# EAGLE schematic PWM-Power-Box_simplified_R1.0 (EAGLE 9.5.0)
REV: 1

## Sheet 1 of 7
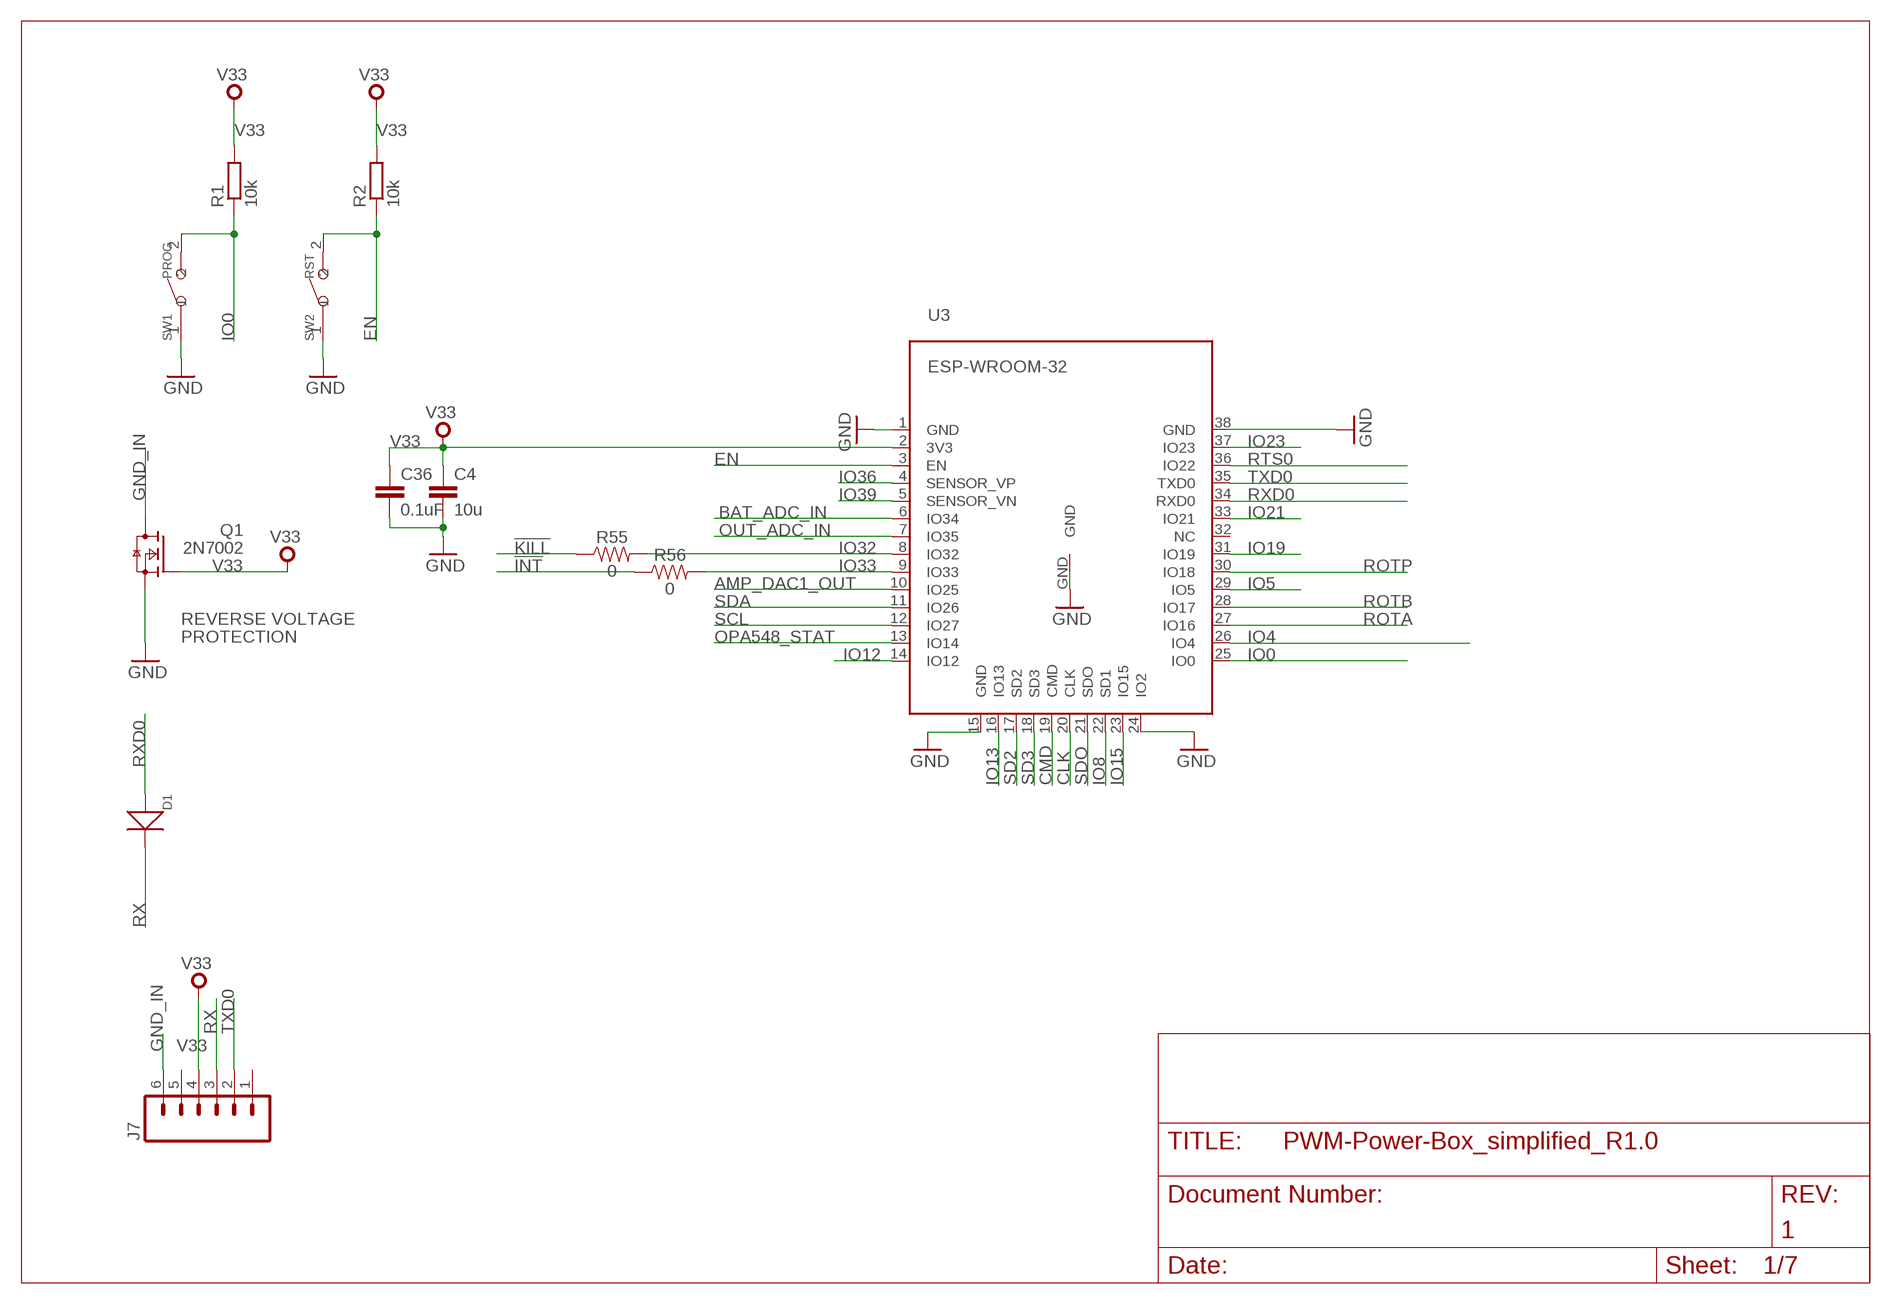
[diagram p0: schematic, sheet 1]

### Parts
C4  10u  C-EUC0603  [C0603]
C36  0.1uF  C-EUC0603  [C0603]
D1  DIODE'0805'  [SOD-323]
J7  M06SILK_FEMALE_PTH  [1X06]
Q1  2N7002  2N7002E  [SOT23]
R1  10k  R-EU_R0603  [R0603]
R2  10k  R-EU_R0603  [R0603]
R55  0  1KOHM-0603-1/10W-1%  [0603]
R56  0  1KOHM-0603-1/10W-1%  [0603]
SW1  PROG  SMD-BUTTON(2P-6.0X3.0X2.5MM)-DHT-1163S  [SW2-4.0-6.0X3.0X2.5MM]
SW2  RST  SMD-BUTTON(2P-6.0X3.0X2.5MM)-DHT-1163S  [SW2-4.0-6.0X3.0X2.5MM]
U3  ESP-WROOM-32  [ESP-WROOM-32]

### Nets
!INT: R56.1 ; also sheet 6
!KILL: R55.1 ; also sheet 6
AMP_DAC1_OUT: U3.10(IO25) ; also sheet 3
BAT_ADC_IN: U3.6(IO34) ; also sheet 5
CLK: U3.20(CLK)
CMD: U3.19(CMD)
EN: R2.1 SW2.2 U3.3(EN) ; also sheet 4
GND [gnd]: C4.2 C36.2 Q1.2(S) SW1.1 SW2.1 U3.1(GND) U3.15(GND) U3.24(IO2) U3.38(GND) U3.GND ; also sheet 2,3,4,5,6
GND_IN [gnd]: J7.6 Q1.3(D)
IO0: R1.1 SW1.2 U3.25(IO0) ; also sheet 4
IO4: U3.26(IO4)
IO5: U3.29(IO5)
IO8: U3.22(SD1)
IO12: U3.14(IO12)
IO13: U3.16(IO13)
IO15: U3.23(IO15)
IO19: U3.31(IO19)
IO21: U3.33(IO21)
IO23: U3.37(IO23)
IO32: R55.2 U3.8(IO32)
IO33: R56.2 U3.9(IO33)
IO36: U3.4(SENSOR_VP)
IO39: U3.5(SENSOR_VN)
OPA548_STAT: U3.13(IO14) ; also sheet 3
OUT_ADC_IN: U3.7(IO35) ; also sheet 5
ROTA: U3.27(IO16) ; also sheet 4
ROTB: U3.28(IO17) ; also sheet 4
ROTP: U3.30(IO18) ; also sheet 4
RTS0: U3.36(IO22)
RX: D1.- J7.3
RXD0: D1.+ U3.34(RXD0) ; also sheet 4
SCL: U3.12(IO27) ; also sheet 4
SD2: U3.17(SD2)
SD3: U3.18(SD3)
SDA: U3.11(IO26) ; also sheet 4
SDO: U3.21(SDO)
TXD0: J7.2 U3.35(TXD0) ; also sheet 4
V33: C4.1 C36.1 J7.4 Q1.1(G) R1.2 R2.2 U3.2(3V3) ; also sheet 2,3,4,5
Unconnected: J7.1 J7.5 U3.32(NC)

### Notes on the sheet
- REVERSE VOLTAGE
- PROTECTION

## Sheet 2 of 7
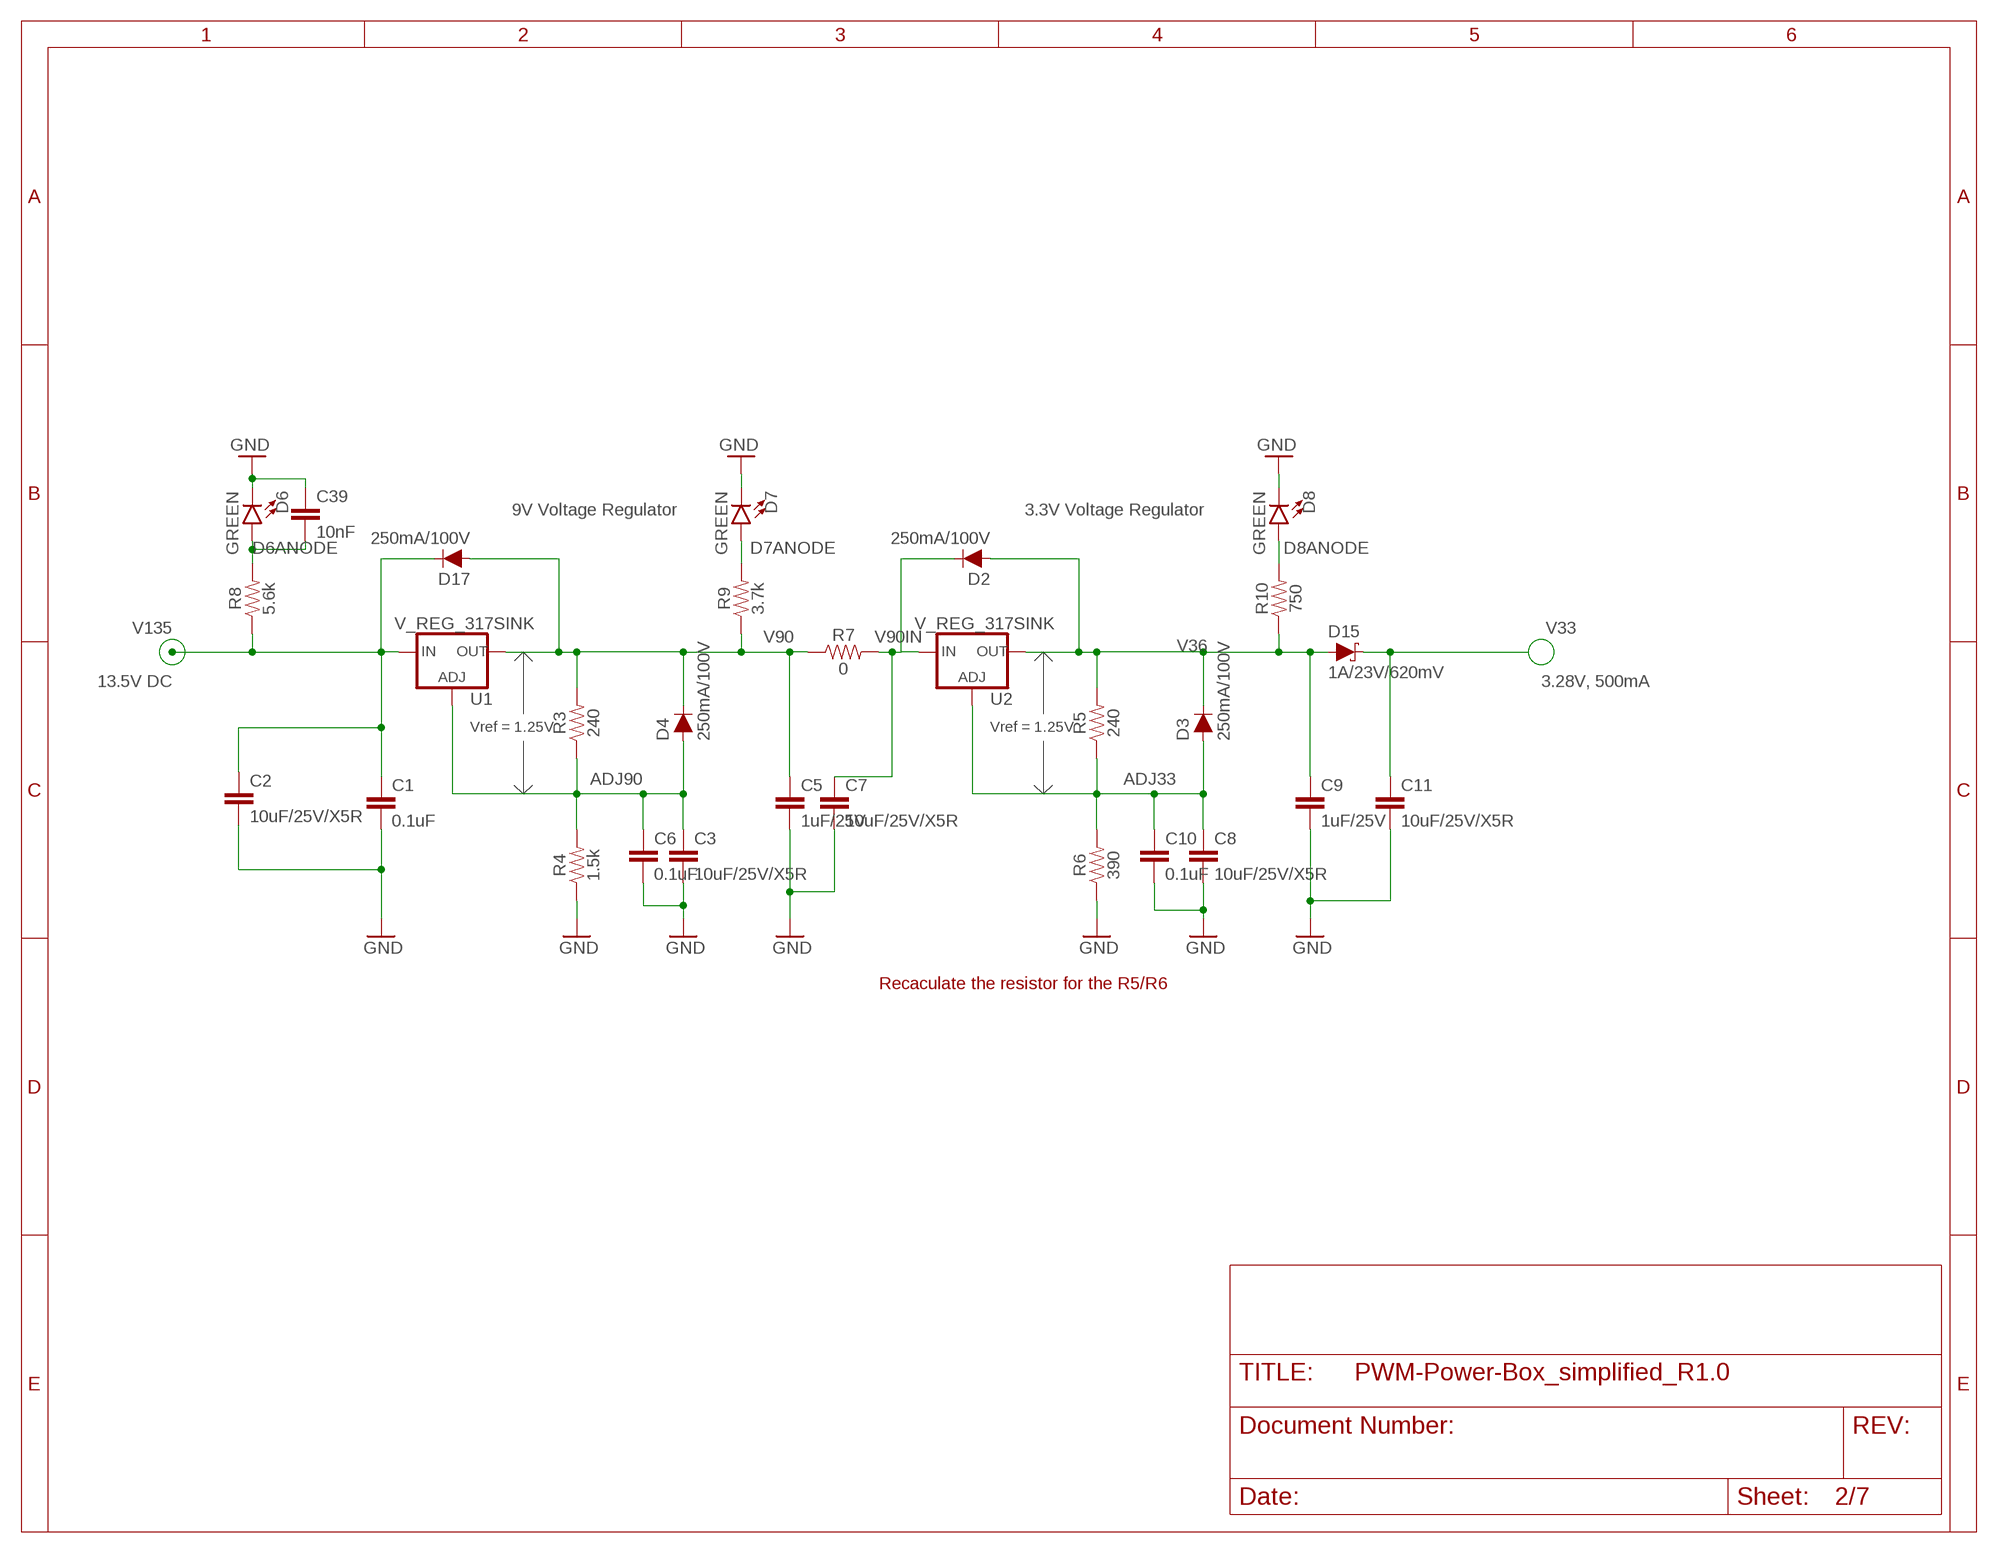
[diagram p1: schematic, sheet 2]

### Parts
C1  0.1uF  C-EUC0805K  [C0805K]
C2  10uF/25V/X5R  C-EUC1210K  [C1210K]
C3  10uF/25V/X5R  C-EUC0805  [C0805]
C5  1uF/25V  C-EUC0805K  [C0805K]
C6  0.1uF  C-EUC0603  [C0603]
C7  10uF/25V/X5R  C-EUC1210K  [C1210K]
C8  10uF/25V/X5R  C-EUC0603  [C0603]
C9  1uF/25V  C-EUC0805K  [C0805K]
C10  0.1uF  C-EUC0603  [C0603]
C11  10uF/25V/X5R  C-EUC1210K  [C1210K]
C39  10nF  C-EUC0603  [C0603]
D2  250mA/100V  DIODE-BAS16J  [SOD-323]
D3  250mA/100V  DIODE-BAS16J  [SOD-323]
D4  250mA/100V  DIODE-BAS16J  [SOD-323]
D6  GREEN  LED-GREEN0603  [LED-0603]
D7  GREEN  LED-GREEN0603  [LED-0603]
D8  GREEN  LED-GREEN0603  [LED-0603]
D15  1A/23V/620mV  DIODE-SCHOTTKY-BAT20J  [SOD-323]
D17  250mA/100V  DIODE-BAS16J  [SOD-323]
R3  240  1.5KOHM-0603-1/10W-1%  [0603]
R4  1.5k  1.5KOHM-0603-1/10W-1%  [0603]
R5  240  1.5KOHM-0603-1/10W-1%  [0603]
R6  390  1.5KOHM-0603-1/10W-1%  [0603]
R7  0  0.1OHM-1210-1/2W-1%  [1210]
R8  5.6k  1.5KOHM-0603-1/10W-1%  [0603]
R9  3.7k  1.5KOHM-0603-1/10W-1%  [0603]
R10  750  1.5KOHM-0603-1/10W-1%  [0603]
U1  V_REG_317SINK  [TO220-ADJ]
U2  V_REG_317SINK  [TO220-ADJ]

### Nets
ADJ33: C8.1 C10.1 D3.A R5.1 R6.2 U2.ADJ
ADJ90: C3.1 C6.1 D4.A R3.1 R4.2 U1.ADJ
D6ANODE: C39.2 D6.A R8.2
D7ANODE: D7.A R9.2
D8ANODE: D8.A R10.2
GND [gnd]: C1.2 C2.2 C3.2 C5.2 C6.2 C7.2 C8.2 C9.2 C10.2 C11.2 C39.1 D6.C D7.C D8.C R4.1 R6.1 ; also sheet 1,3,4,5,6
V33: C11.1 D15.C ; also sheet 1,3,4,5
V36: C9.1 D2.A D3.C D15.A R5.2 R10.1 U2.OUT
V90: C5.1 D4.C D17.A R3.2 R7.1 R9.1 U1.OUT
V90IN: C7.1 D2.C R7.2 U2.IN
V135: C1.1 C2.1 D17.C R8.1 U1.IN ; also sheet 3,5,6

### Notes on the sheet
- 9V Voltage Regulator | 3.3V Voltage Regulator
- 13.5V DC | 3.28V, 500mA
- Vref = 1.25V | Vref = 1.25V
- Recaculate the resistor for the R5/R6

## Sheet 3 of 7
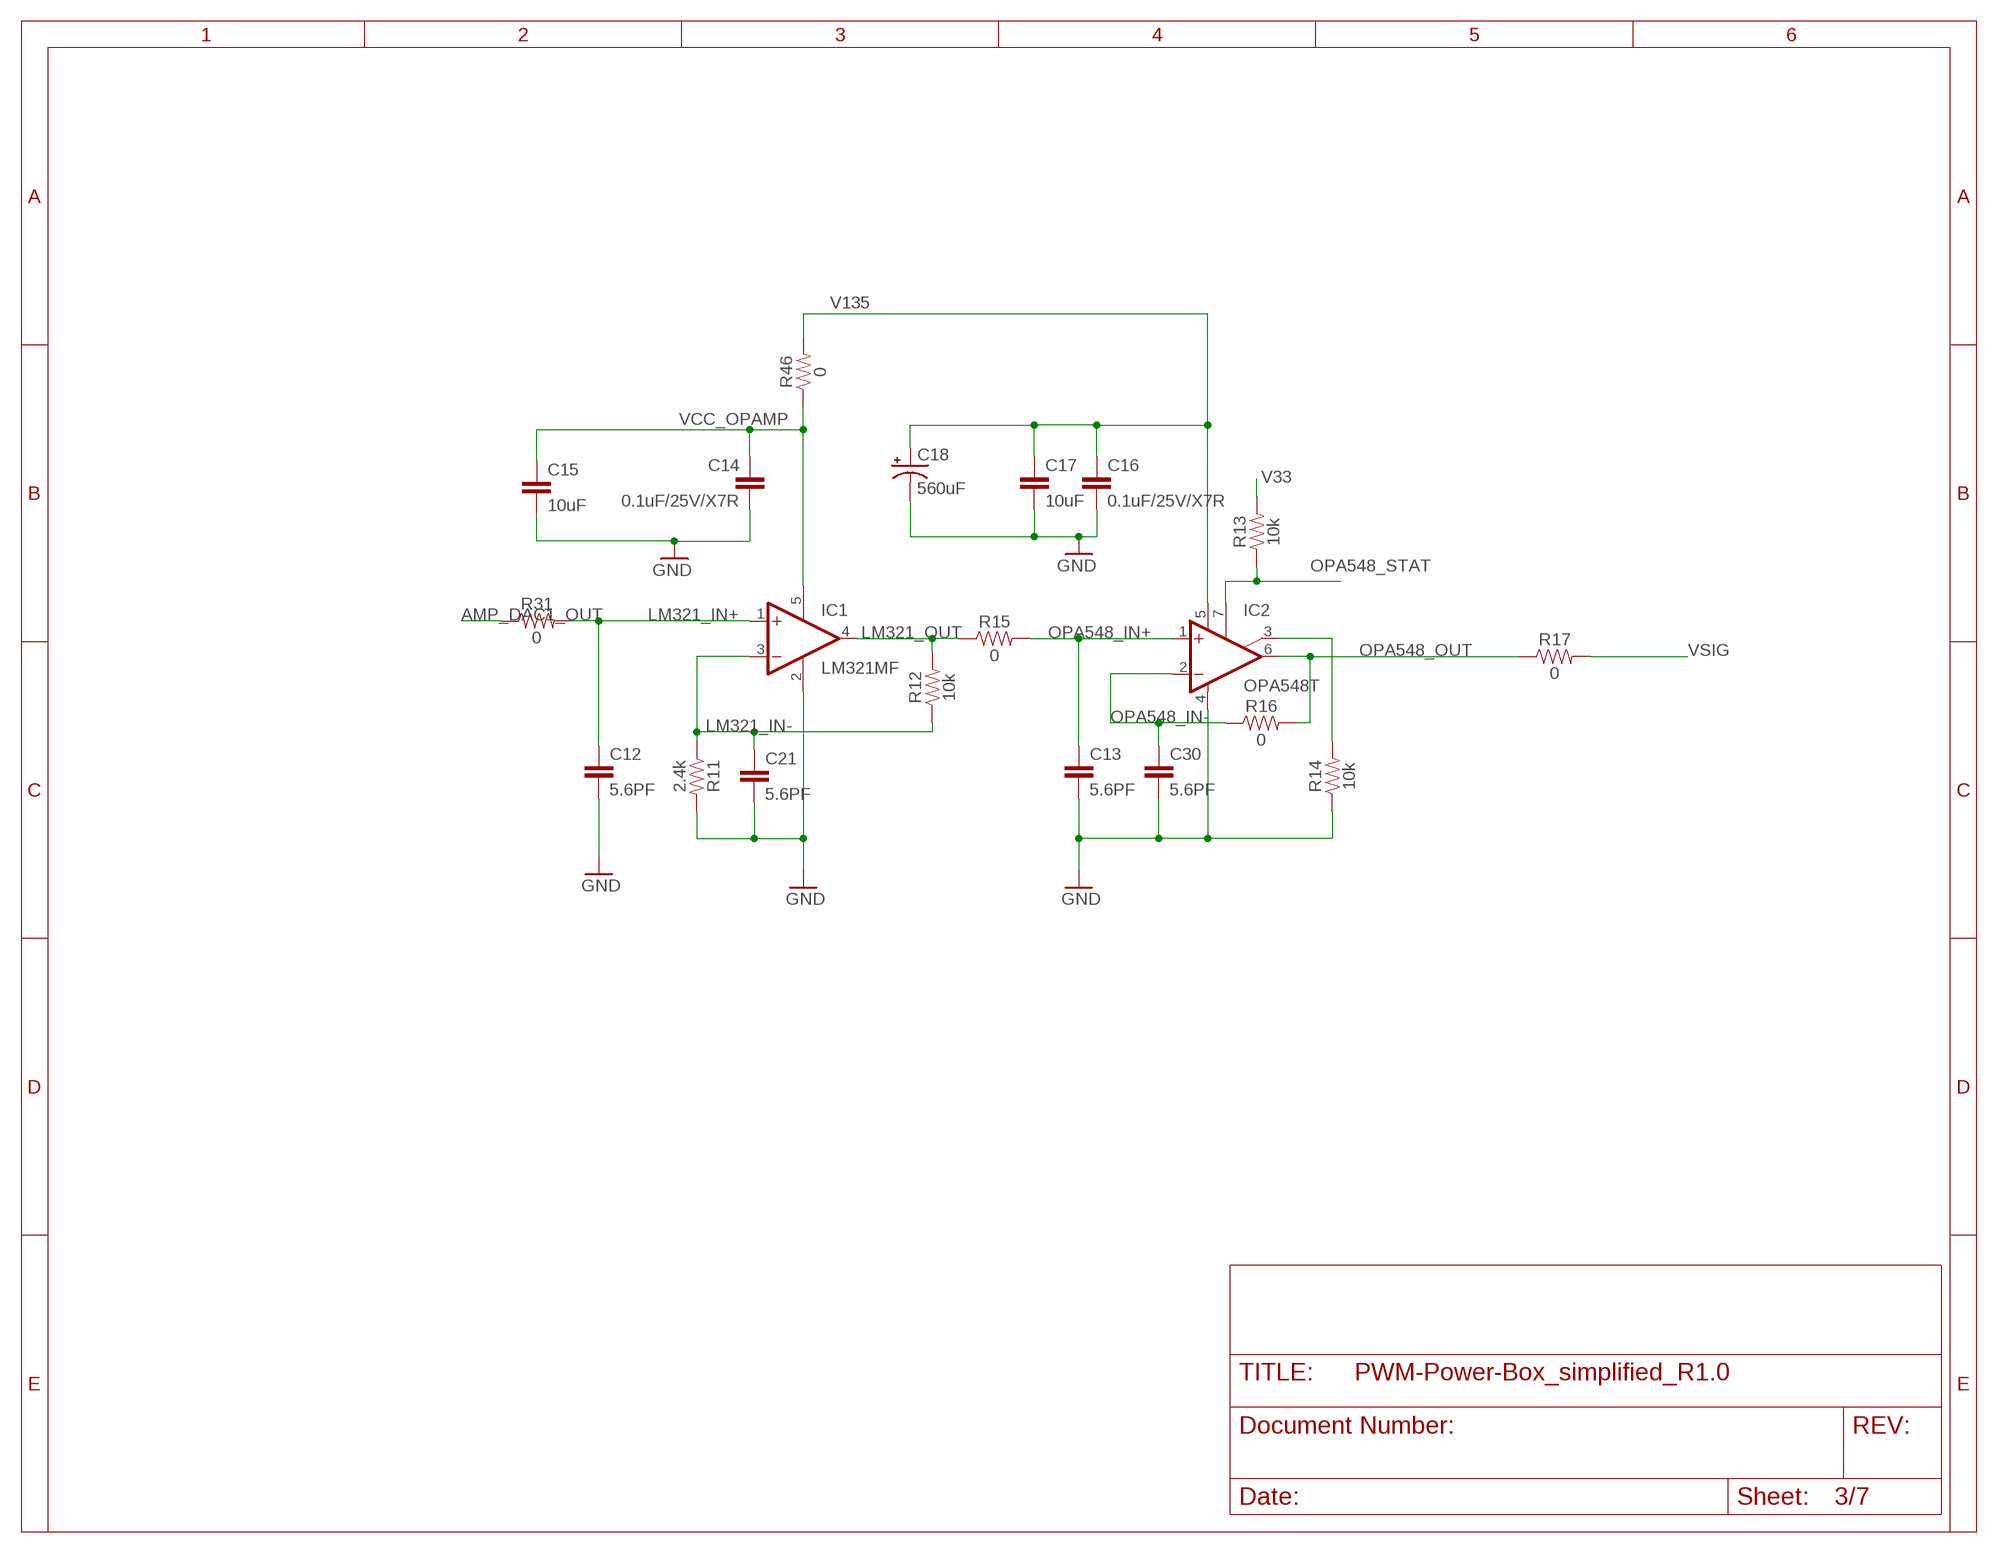
[diagram p2: schematic, sheet 3]

### Parts
C12  5.6PF  5.6PF-0603-50V-5%  [0603]
C13  5.6PF  5.6PF-0603-50V-5%  [0603]
C14  0.1uF/25V/X7R  5.6PF-0603-50V-5%  [0603]
C15  10uF  10UF-1206-6.3V-20%  [1206]
C16  0.1uF/25V/X7R  5.6PF-0603-50V-5%  [0603]
C17  10uF  10UF-1206-6.3V-20%  [1206]
C18  560uF  560UF-PANASONIC_G-25V-20%  [PANASONIC_G]
C21  5.6PF  5.6PF-0603-50V-5%  [0603]
C30  5.6PF  5.6PF-0603-50V-5%  [0603]
IC1  LM321MF  [SOT23-5]
IC2  OPA548T  [TO220-7]
R11  2.4k  1.5KOHM-0603-1/10W-1%  [0603]
R12  10k  1.5KOHM-0603-1/10W-1%  [0603]
R13  10k  1.5KOHM-0603-1/10W-1%  [0603]
R14  10k  1.5KOHM-0603-1/10W-1%  [0603]
R15  0  1.5KOHM-0603-1/10W-1%  [0603]
R16  0  1.5KOHM-0603-1/10W-1%  [0603]
R17  0  0.1OHM-1210-1/2W-1%  [1210]
R31  0  1.5KOHM-0603-1/10W-1%  [0603]
R46  0  1.5KOHM-0603-1/10W-1%  [0603]

### Nets
AMP_DAC1_OUT: R31.1 ; also sheet 1
GND [gnd]: C12.2 C13.2 C14.2 C15.2 C16.2 C17.2 C18.- C21.2 C30.2 IC1.2(V-) IC2.4(V-) R11.2 R14.1 ; also sheet 1,2,4,5,6
LM321_IN+: C12.1 IC1.1(+IN) R31.2
LM321_IN-: C21.1 IC1.3(-IN) R11.1 R12.1
LM321_OUT: IC1.4(OUT) R12.2 R15.1
N$12: IC2.3(ILIM) R14.2
OPA548_IN+: C13.1 IC2.1(+IN) R15.2
OPA548_IN-: C30.1 IC2.2(-IN) R16.1
OPA548_OUT: IC2.6(OUT) R16.2 R17.1 ; also sheet 5
OPA548_STAT: IC2.7(E/S) R13.1 ; also sheet 1
V33: R13.2 ; also sheet 1,2,4,5
V135: C16.1 C17.1 C18.+ IC2.5(V+) R46.2 ; also sheet 2,5,6
VCC_OPAMP: C14.1 C15.1 IC1.5(V+) R46.1
VSIG: R17.2 ; also sheet 6

## Sheet 4 of 7
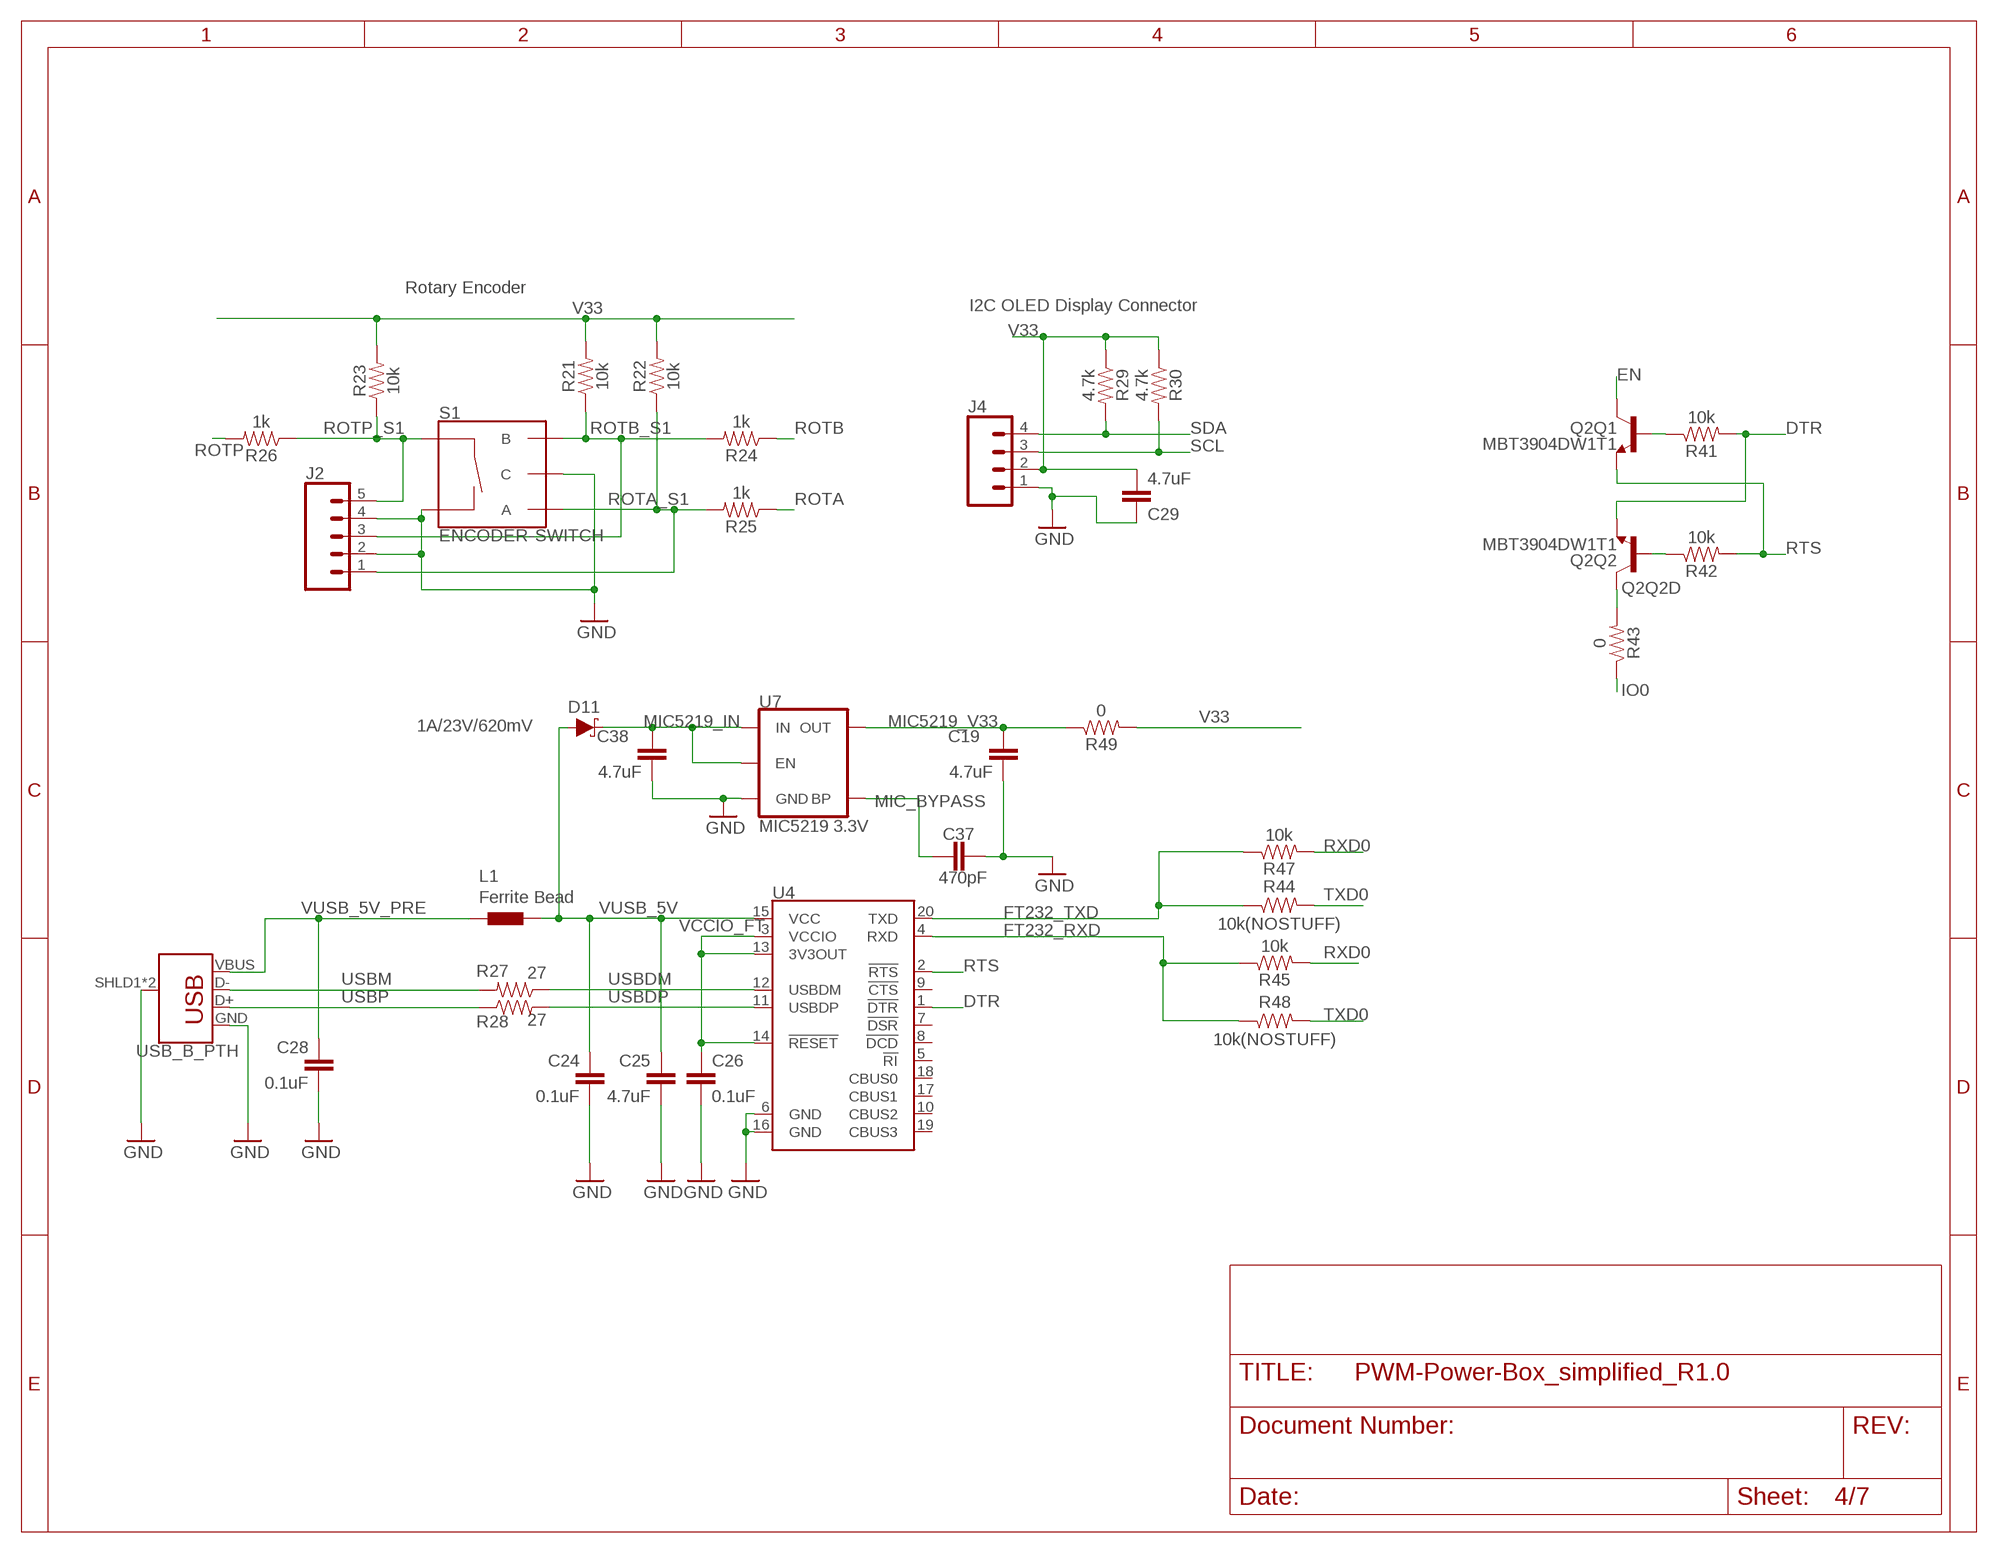
[diagram p3: schematic, sheet 4]

### Parts
C19  4.7uF  5.6PF-0603-50V-5%  [0603]
C24  0.1uF  5.6PF-0603-50V-5%  [0603]
C25  4.7uF  5.6PF-0603-50V-5%  [0603]
C26  0.1uF  5.6PF-0603-50V-5%  [0603]
C28  0.1uF  5.6PF-0603-50V-5%  [0603]
C29  4.7uF  5.6PF-0603-50V-5%  [0603]
C37  470pF  5.6PF-0603-50V-5%  [0603]
C38  4.7uF  5.6PF-0603-50V-5%  [0603]
D11  1A/23V/620mV  DIODE-SCHOTTKY-BAT20J  [SOD-323]
J2  CONN_05  [1X05]
J3  USB_B_PTH  [USB-B-PTH]
J4  CONN_04  [1X04]
L1  Ferrite Bead  BLM15HB121SN1  [0402]
Q2  MBT3904DW1T1  TRANS_NPN_DUAL-MBT3904DW1T1  [SC70-6]
R21  10k  1.5KOHM-0603-1/10W-1%  [0603]
R22  10k  1.5KOHM-0603-1/10W-1%  [0603]
R23  10k  1.5KOHM-0603-1/10W-1%  [0603]
R24  1k  1.5KOHM-0603-1/10W-1%  [0603]
R25  1k  1.5KOHM-0603-1/10W-1%  [0603]
R26  1k  1.5KOHM-0603-1/10W-1%  [0603]
R27  27  1.5KOHM-0603-1/10W-1%  [0603]
R28  27  1.5KOHM-0603-1/10W-1%  [0603]
R29  4.7k  1.5KOHM-0603-1/10W-1%  [0603]
R30  4.7k  1.5KOHM-0603-1/10W-1%  [0603]
R41  10k  1.5KOHM-0603-1/10W-1%  [0603]
R42  10k  1.5KOHM-0603-1/10W-1%  [0603]
R43  0  1.5KOHM-0603-1/10W-1%  [0603]
R44  10k(NOSTUFF)  1.5KOHM-0603-1/10W-1%  [0603]
R45  10k  1.5KOHM-0603-1/10W-1%  [0603]
R47  10k  1.5KOHM-0603-1/10W-1%  [0603]
R48  10k(NOSTUFF)  1.5KOHM-0603-1/10W-1%  [0603]
R49  0  1.5KOHM-0603-1/10W-1%  [0603]
S1  ENCODER-SWITCH  [ROTARY_ENC_PLAIN]
U4  FT231XS  [SSOP20_L]
U7  MIC5219 3.3V  V_REG_MIC52193.3V  [SOT23-5]

### Nets
DTR: Q2.1(Q2:E) R41.2 U4.1(!DTR)
EN: Q2.3(Q1:C) ; also sheet 1
FT232_RXD: R45.1 R48.1 U4.4(RXD)
FT232_TXD: R44.1 R47.1 U4.20(TXD)
GND [gnd]: C19.2 C24.2 C25.2 C26.2 C28.2 C29.1 C37.2 C38.2 J2.2 J2.4 J3.GND J3.SHLD1(SHIELD) J3.SHLD2(SHIELD) J4.1 S1.C S1.SW- U4.6(GND) U4.16(GND) U7.2(GND) ; also sheet 1,2,3,5,6
IO0: R43.1 ; also sheet 1
MIC5219_IN: C38.1 D11.C U7.1(IN) U7.3(EN)
MIC5219_V33: C19.1 R49.1 U7.5(OUT)
MIC_BYPASS: C37.1 U7.4(BP)
N$27: Q2.5(Q1:B) R41.1
N$33: Q2.2(Q2:B) R42.1
Q2Q2D: Q2.6(Q2:C) R43.2
ROTA: R25.1 ; also sheet 1
ROTA_S1: J2.1 R22.1 R25.2 S1.A
ROTB: R24.1 ; also sheet 1
ROTB_S1: J2.3 R21.1 R24.2 S1.B
ROTP: R26.2 ; also sheet 1
ROTP_S1: J2.5 R23.1 R26.1 S1.SW+
RTS: Q2.4(Q1:E) R42.2 U4.2(!RTS)
RXD0: R45.2 R47.2 ; also sheet 1
SCL: J4.3 R30.2 ; also sheet 1
SDA: J4.4 R29.2 ; also sheet 1
TXD0: R44.2 R48.2 ; also sheet 1
USBDM: R27.1 U4.12(USBDM)
USBDP: R28.2 U4.11(USBDP)
USBM: J3.D- R27.2
USBP: J3.D+ R28.1
V33: C29.2 J4.2 R21.2 R22.2 R23.2 R29.1 R30.1 R49.2 ; also sheet 1,2,3,5
VCCIO_FT: C26.1 U4.3(VCCIO) U4.13(3V3OUT) U4.14(!RESET)
VUSB_5V: C24.1 C25.1 D11.A L1.2 U4.15(VCC)
VUSB_5V_PRE: C28.1 J3.VBUS L1.1
Unconnected: U4.5(!RI) U4.7(!DSR) U4.8(!DCD) U4.9(!CTS) U4.10(CBUS2) U4.17(CBUS1) U4.18(CBUS0) U4.19(CBUS3)

### Notes on the sheet
- Rotary Encoder
- I2C OLED Display Connector

## Sheet 5 of 7
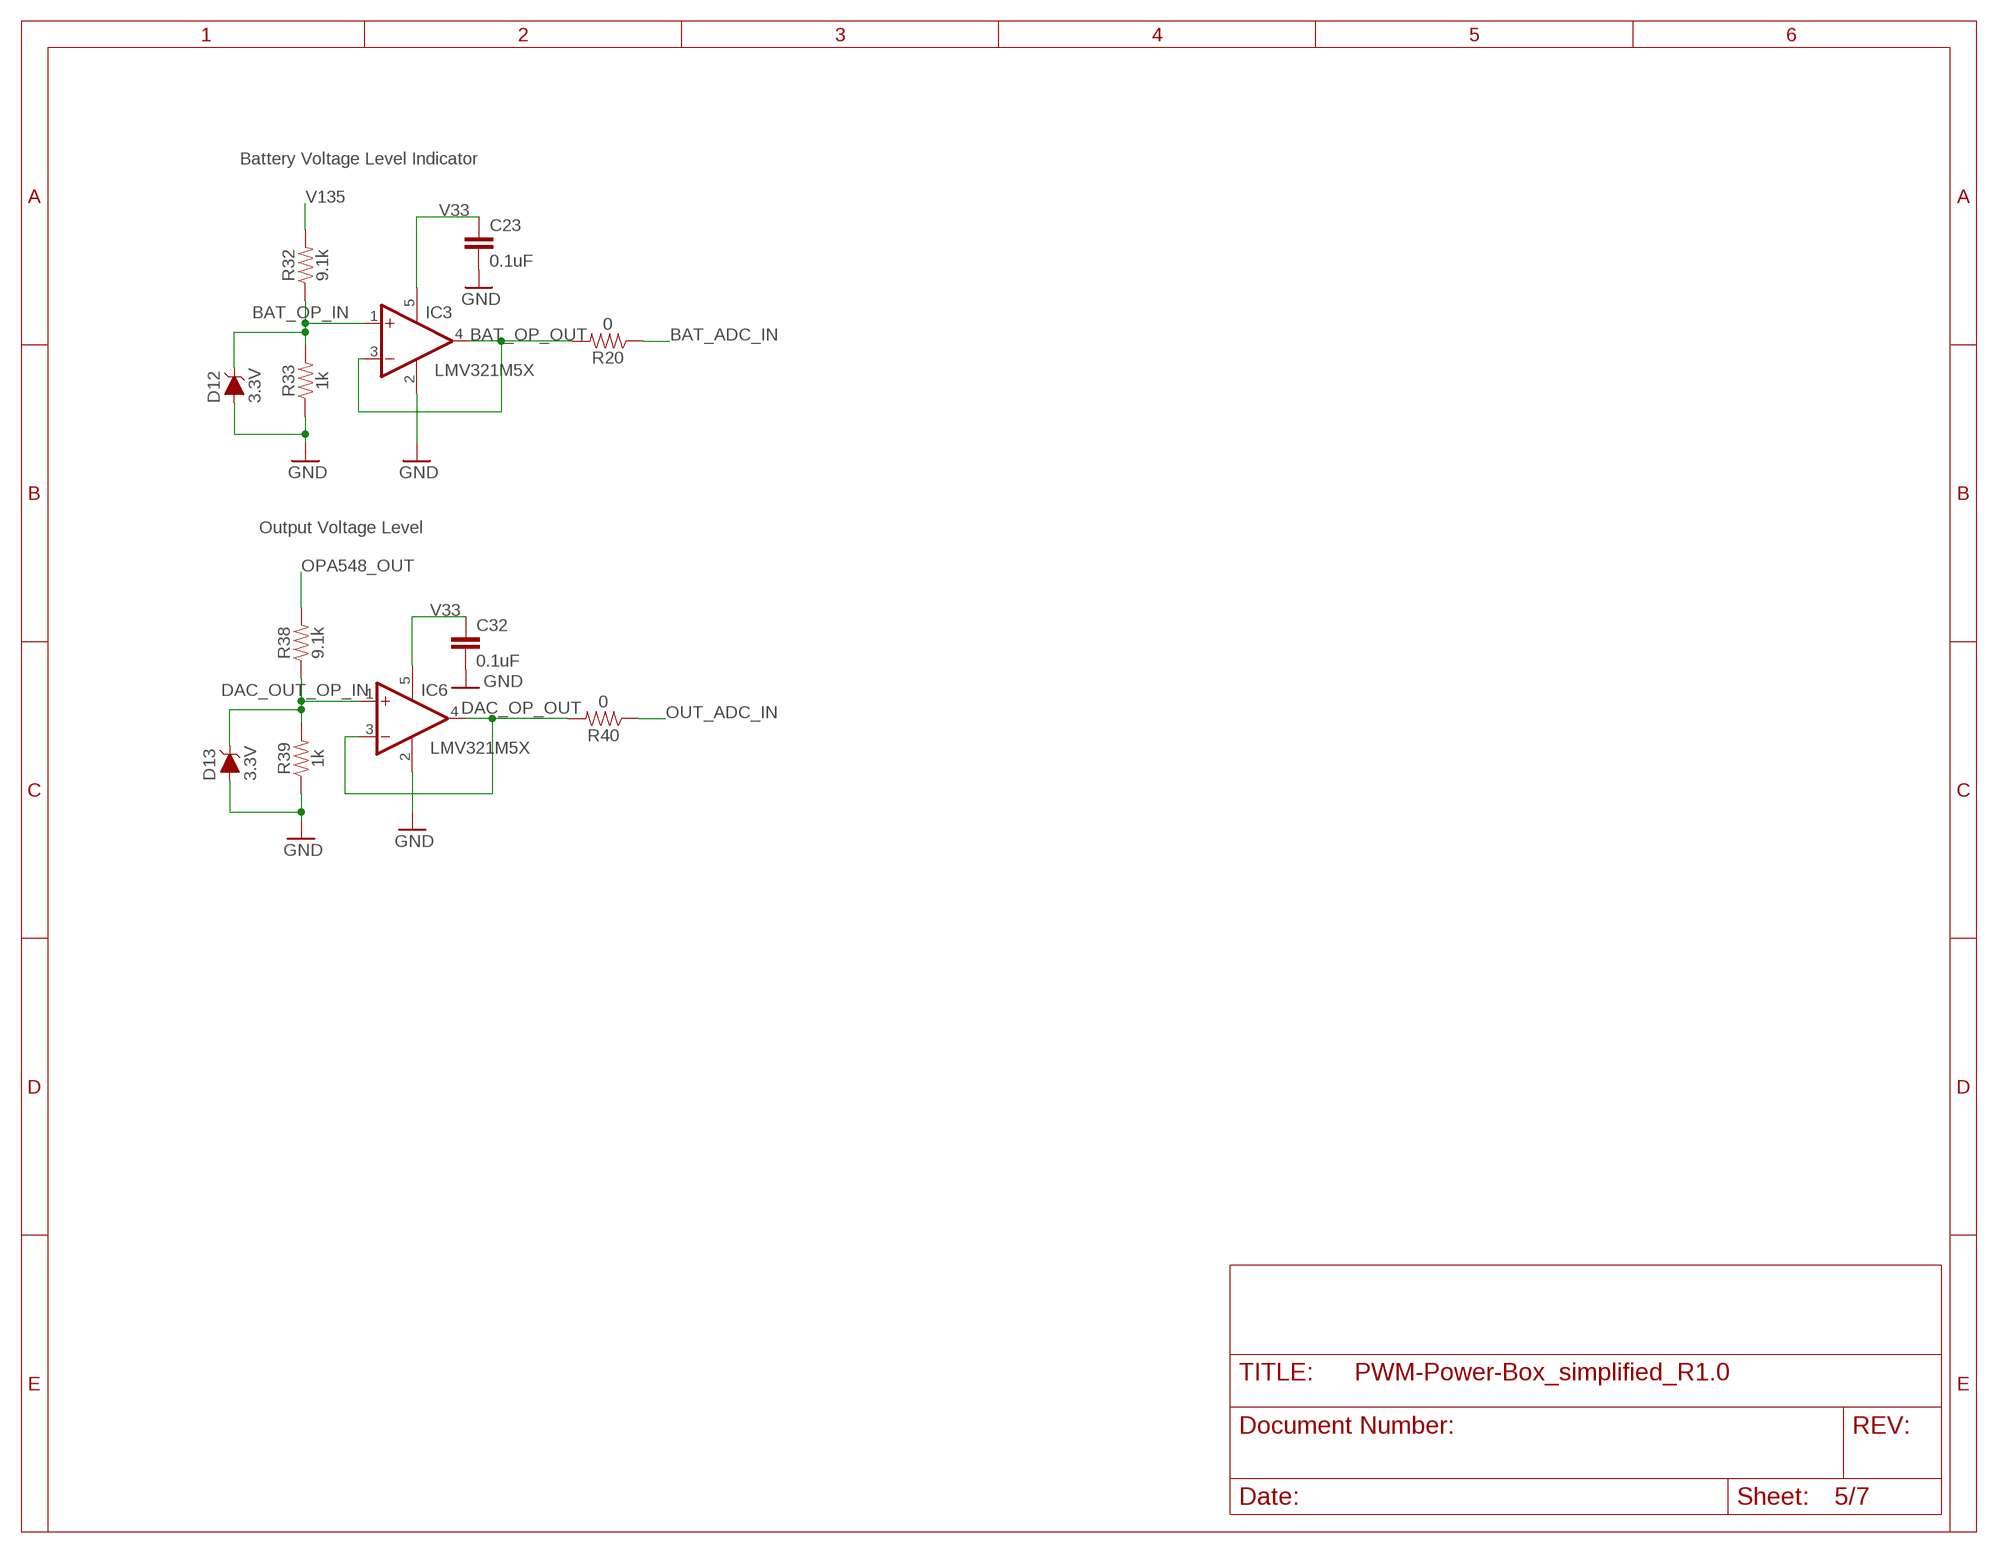
[diagram p4: schematic, sheet 5]

### Parts
C23  0.1uF  5.6PF-0603-50V-5%  [0603]
C32  0.1uF  5.6PF-0603-50V-5%  [0603]
D12  3.3V  DIODE-ZENER-MM3Z3V3T1G  [SOD-323]
D13  3.3V  DIODE-ZENER-MM3Z3V3T1G  [SOD-323]
IC3  LMV321M5X  [SOT23-5]
IC6  LMV321M5X  [SOT23-5]
R20  0  1.5KOHM-0603-1/10W-1%  [0603]
R32  9.1k  1.5KOHM-0603-1/10W-1%  [0603]
R33  1k  1.5KOHM-0603-1/10W-1%  [0603]
R38  9.1k  1.5KOHM-0603-1/10W-1%  [0603]
R39  1k  1.5KOHM-0603-1/10W-1%  [0603]
R40  0  1.5KOHM-0603-1/10W-1%  [0603]

### Nets
BAT_ADC_IN: R20.1 ; also sheet 1
BAT_OP_IN: D12.C IC3.1(+IN) R32.1 R33.2
BAT_OP_OUT: IC3.3(-IN) IC3.4(OUT) R20.2
DAC_OP_OUT: IC6.3(-IN) IC6.4(OUT) R40.2
DAC_OUT_OP_IN: D13.C IC6.1(+IN) R38.1 R39.2
GND [gnd]: C23.2 C32.2 D12.A D13.A IC3.2(V-) IC6.2(V-) R33.1 R39.1 ; also sheet 1,2,3,4,6
OPA548_OUT: R38.2 ; also sheet 3
OUT_ADC_IN: R40.1 ; also sheet 1
V33: C23.1 C32.1 IC3.5(V+) IC6.5(V+) ; also sheet 1,2,3,4
V135: R32.2 ; also sheet 2,3,6

### Notes on the sheet
- Battery Voltage Level Indicator
- Output Voltage Level

## Sheet 6 of 7
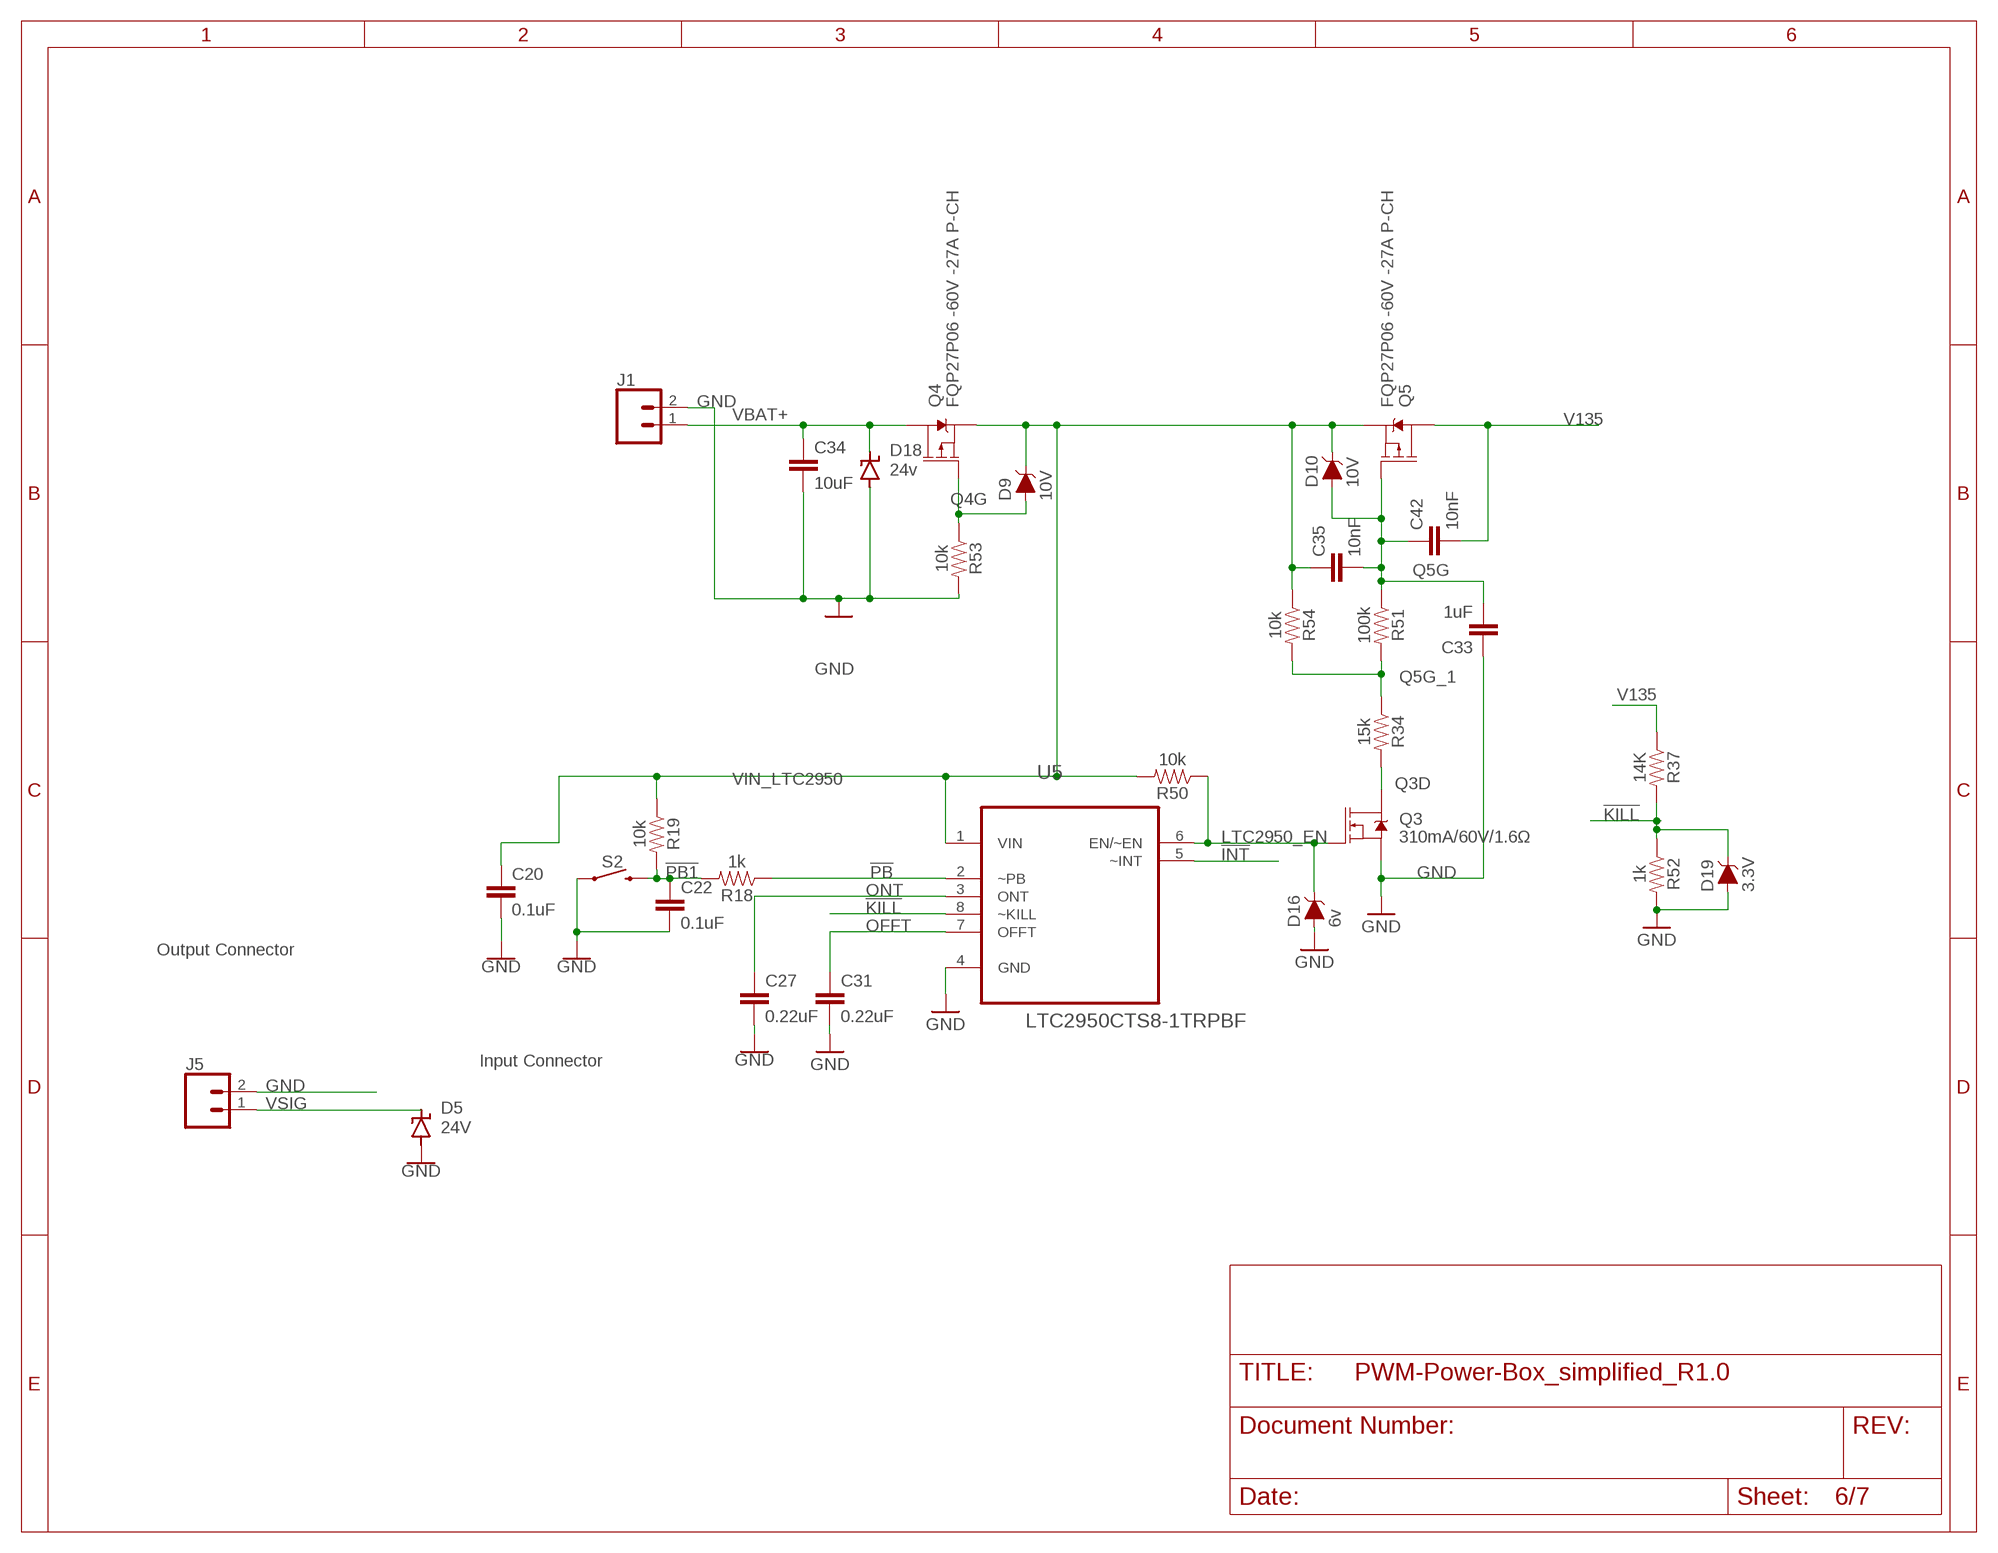
[diagram p5: schematic, sheet 6]

### Parts
C20  0.1uF  10UF-0603-6.3V-20%  [0603]
C22  0.1uF  10UF-0603-6.3V-20%  [0603]
C27  0.22uF  10UF-0603-6.3V-20%  [0603]
C31  0.22uF  10UF-0603-6.3V-20%  [0603]
C33  1uF  10UF-0603-6.3V-20%  [0603]
C34  10uF  10UF-1210-50V-20%  [1210]
C35  10nF  10UF-0603-6.3V-20%  [0603]
C42  10nF  10UF-0603-6.3V-20%  [0603]
D5  24V  SUPPRESSOR-SMBG  [SMBG]
D9  10V  DIODE-ZENER-BZT52C3V6S  [SOD-323]
D10  10V  DIODE-ZENER-BZT52C3V6S  [SOD-323]
D16  6v  DIODE-ZENER-BZT52C3V6S  [SOD-323]
D18  24v  SUPPRESSOR-SMBG  [SMBG]
D19  3.3V  DIODE-ZENER-BZT52C3V6S  [SOD-323]
J1  CONN_025MM  [SCREWTERMINAL-5MM-2]
J5  CONN_025MM  [SCREWTERMINAL-5MM-2]
Q3  310mA/60V/1.6Ω  MOSFET-NCH-2N7002PW  [SOT323]
Q4  FQP27P06 -60V -27A P-CH  MOSFET_PCH-NDP6020P  [TO220V]
Q5  FQP27P06 -60V -27A P-CH  MOSFET_PCH-NDP6020P  [TO220V]
R18  1k  100KOHM-0603-1/10W-1%  [0603]
R19  10k  100KOHM-0603-1/10W-1%  [0603]
R34  15k  100KOHM-0603-1/10W-1%  [0603]
R37  14K  100KOHM-0603-1/10W-1%  [0603]
R50  10k  100KOHM-0603-1/10W-1%  [0603]
R51  100k  100KOHM-0603-1/10W-1%  [0603]
R52  1k  100KOHM-0603-1/10W-1%  [0603]
R53  10k  100KOHM-0603-1/10W-1%  [0603]
R54  10k  100KOHM-0603-1/10W-1%  [0603]
S2  MOMENTARY-SWITCH-SPST-PTH-RIGHT-ANGLE-KIT  [TACTILE_SWITCH_PTH_RIGHT_ANGLE_KIT]
U5  LTC2950CTS8-1TRPBF  [SOT65P280X100-8N]

### Nets
!INT: U5.5(~INT) ; also sheet 1
!KILL: D19.C R37.2 R52.1 U5.8(~KILL) ; also sheet 1
!PB: R18.1 U5.2(~PB)
!PB1: C22.1 R18.2 R19.2 S2.2
GND [gnd]: C20.2 C22.2 C27.2 C31.2 C33.1 C34.2 D5.A D16.A D18.A D19.A J1.2 J5.2 Q3.2(S) R52.2 R53.2 S2.1 U5.4(GND) ; also sheet 1,2,3,4,5
LTC2950_EN: D16.C Q3.1(G) R50.1 U5.6(EN/~EN)
OFFT: C31.1 U5.7(OFFT)
ONT: C27.1 U5.3(ONT)
Q3D: Q3.3(D) R34.2
Q4G: D9.A Q4.1(G) R53.1
Q5G: C33.2 C35.2 C42.1 D10.A Q5.1(G) R51.1
Q5G_1: R34.1 R51.2 R54.2
V135: C42.2 Q5.2(D) R37.1 ; also sheet 2,3,5
VBAT+: C34.1 D18.C J1.1 Q4.2(D)
VIN_LTC2950: C20.1 C35.1 D9.C D10.C Q4.3(S) Q5.3(S) R19.1 R50.2 R54.1 U5.1(VIN)
VSIG: D5.C J5.1 ; also sheet 3

### Notes on the sheet
- Output Connector
- Input Connector

## Sheet 7 of 7

## Library data of the parts
C1-C3 C5-C11 C39 = rcl:C-EU: CAPACITOR, European symbol; SPICEPREFIX: C
C4 C36 = rcl:C-EU: CAPACITOR, European symbol
C12 C13 C21 C30 = SparkFun-Capacitors:5.6PF: 5.6pF ceramic capacitors A capacitor is a passive two-terminal electrical component used to store electrical energy temporarily in an electric field.; PROD_ID: CAP-12456
C14 C16 C19 C23-C26 C28 C29 C32 C37 C38 = SparkFun-Capacitors:5.6PF: 5.6pF ceramic capacitors A capacitor is a passive two-terminal electrical component used to store electrical energy temporarily in an electric field.; PROD_ID: CAP-12456; VALUE: 5.6PF
C15 C17 = SparkFun-Capacitors:10UF: 10.0µF ceramic capacitors A capacitor is a passive two-terminal electrical component used to store electrical energy temporarily in an electric field.; PROD_ID: CAP-10057
C18 = SparkFun-Capacitors:560UF: 560µF polarized capacitors A capacitor is a passive two-terminal electrical component used to store electrical energy temporarily in an electric field.; PROD_ID: CAP-09983
C20 C22 C27 C31 C33 C35 C42 = SparkFun-Capacitors:10UF: 10.0µF ceramic capacitors A capacitor is a passive two-terminal electrical component used to store electrical energy temporarily in an electric field.; PROD_ID: CAP-11015; VALUE: 10uF
C34 = SparkFun-Capacitors:10UF: 10.0µF ceramic capacitors A capacitor is a passive two-terminal electrical component used to store electrical energy temporarily in an electric field.; PROD_ID: CAP-09824
D1 = Seeed-OPL-Diode:DIODE*
D2-D4 D17 = SparkFun-DiscreteSemi:DIODE: Diode These are standard reverse protection diodes and small signal diodes. SparkFun Products: SparkFun SparkPunk Sound Kit <https://www.sparkfun.com/products/11177> SparkFun ESP8266 Thing <https://www.sparkfun.com/products/13231>; PROD_ID: DIO-09646
D5 D18 = diode:SUPPRESSOR-: Suppressor diode
D6-D8 = SparkFun-LED:LED-GREEN: Green SMD LED Used in manufacturing of various products at SparkFun Packages: 0603 - SMD 0603 package [Product Link] <http://www.futureelectronics.com/en/technologies/semiconductors/optoelectronics/leds/Pages/9894312-LTST-C190GKT.aspx?CrossPart=HSMG-C190&IM=0> LilyPad 1206 - SMD1206 LilyPad package [Product Link] <http://www.futureelectronics.com/en/Technologies/Product.aspx?ProductID=IN150NGHARVATEKCORPORATION2049943&IM=0> 1206 - SMD1206 package [Product Link] <http://www.futureelectronics.com/en/technologies/semiconductors/optoelectronics/leds/Pages/8315665-LTST-C150KGKT.aspx?IM=0> 1206 Bottom Mount -SMD 1206 Bottom Mount [Product Link] <http://www.digikey.com/product-detail/en/lite-on-inc/LTST-C230KGKT/160-1456-1-ND/386854> SparkFun Products: Pro Mini 328 -5V <https://www.sparkfun.com/products/821> RedBoard <https://www.sparkfun.com/products/12757> MP3 Trigger <https://www.sparkfun.com/products/13720> Makey Makey <https://www.sparkfun.com/products/11076>; PROD_ID: DIO-00821
D9 D10 D16 D19 = SparkFun-DiscreteSemi:DIODE-ZENER: Zener Diode A Zener diode allows current to flow from its anode to its cathode like a normal semiconductor diode, but it also permits current to flow in the reverse direction when its "Zener voltage" is reached. - WIkipedia; PROD_ID: DIO-08199; VALUE: 3.6V
D11 D15 = SparkFun-DiscreteSemi:DIODE-SCHOTTKY: Schottky diode A Schottky diode is a semiconductor diode which has a low forward voltage drop and a very fast switching action.; PROD_ID: DIO-11623
D12 D13 = SparkFun-DiscreteSemi:DIODE-ZENER: Zener Diode A Zener diode allows current to flow from its anode to its cathode like a normal semiconductor diode, but it also permits current to flow in the reverse direction when its "Zener voltage" is reached. - WIkipedia; PROD_ID: DIO-11284
IC1 = linear:LM321?*: Low Power Single Op Amp Source: http://cache.national.com/ds/LM/LM321.pdf
IC2 = burr-brown:OPA548: Operational Amplifier High-Voltage, High-Current; MF: TEXAS INSTRUMENTS; MPN: OPA548T; OC_FARNELL: 1564885; OC_NEWARK: 69K2680
IC3 IC6 = linear:LMV321?*: General Purpose, Low Voltage, Rail-to-Rail Output Operational Amplifiers Source: http://www.national.com/mpf/LM/LMV321.html http://www.national.com/dt/lmv_qual.pdf
J1 J5 = SparkFun-Connectors:CONN_02: Multi connection point. Often used as Generic Header-pin footprint for 0.1 inch spaced/style header connections On any of the 0.1 inch spaced packages, you can populate with these: Break Away Headers - Straight <https://www.sparkfun.com/products/116> (PRT-00116) Break Away Male Headers - Right Angle <https://www.sparkfun.com/products/553> (PRT-00553) Female Headers <https://www.sparkfun.com/products/115> (PRT-00115) Break Away Headers - Machine Pin <https://www.sparkfun.com/products/117> (PRT-00117) Break Away Female Headers - Swiss Machine Pin <https://www.sparkfun.com/products/743> (PRT-00743) For SCREWTERMINALS and SPRING TERMINALS visit here: Screw Terimnals on SparkFun.com <https://www.sparkfun.com/search/results?term=Screw+Terminals> (5mm/3.5mm/2.54mm spacing) This device is also useful as a general connection point to wire up your design to another part of your project. Our various solder wires solder well into these plated through hole pads. Hook-Up Wire - Assortment (Stranded, 22 AWG) <https://www.sparkfun.com/products/11375> (PRT-11375) Hook-Up Wire - Assortment (Solid Core, 22 AWG) <https://www.sparkfun.com/products/11367> (PRT-11367) View the entire wire category on our website here <https://www.sparkfun.com/categories/141> Special notes: Molex polarized connector foot print use with: PRT-08233 with associated crimp pins and housings. 2.54_SCREWTERM for use with PRT-10571. 3.5mm Screw Terminal footprints for PRT-08084 5mm Screw Terminal footprints for use with PRT-08432; SF_SKU: PRT-08432
J2 = SparkFun-Connectors:CONN_05: Multi connection point. Often used as Generic Header-pin footprint for 0.1 inch spaced/style header connections On any of the 0.1 inch spaced packages, you can populate with these: Break Away Headers - Straight <https://www.sparkfun.com/products/116> (PRT-00116) Break Away Male Headers - Right Angle <https://www.sparkfun.com/products/553> (PRT-00553) Female Headers <https://www.sparkfun.com/products/115> (PRT-00115) Break Away Headers - Machine Pin <https://www.sparkfun.com/products/117> (PRT-00117) Break Away Female Headers - Swiss Machine Pin <https://www.sparkfun.com/products/743> (PRT-00743) For SCREWTERMINALS and SPRING TERMINALS visit here: Screw Terimnals on SparkFun.com <https://www.sparkfun.com/search/results?term=Screw+Terminals> (5mm/3.5mm/2.54mm spacing) This device is also useful as a general connection point to wire up your design to another part of your project. Our various solder wires solder well into these plated through hole pads. Hook-Up Wire - Assortment (Stranded, 22 AWG) <https://www.sparkfun.com/products/11375> (PRT-11375) Hook-Up Wire - Assortment (Solid Core, 22 AWG) <https://www.sparkfun.com/products/11367> (PRT-11367) View the entire wire category on our website here <https://www.sparkfun.com/categories/141> Special notes: Molex polarized connector foot print use with SKU : PRT-08231 with associated crimp pins and housings. 1MM SMD Version SKU: PRT-10208
J3 = SparkFun-Connectors:USB_B: USB Type B Connector SparkFun Products: SparkFun Stepoko <https://www.sparkfun.com/products/13899> PTH; PROD_ID: CONN-08278; SF_ID: PRT-00139
J4 = SparkFun-Connectors:CONN_04: Multi connection point. Often used as Generic Header-pin footprint for 0.1 inch spaced/style header connections On any of the 0.1 inch spaced packages, you can populate with these: Break Away Headers - Straight <https://www.sparkfun.com/products/116> (PRT-00116) Break Away Male Headers - Right Angle <https://www.sparkfun.com/products/553> (PRT-00553) Female Headers <https://www.sparkfun.com/products/115> (PRT-00115) Break Away Headers - Machine Pin <https://www.sparkfun.com/products/117> (PRT-00117) Break Away Female Headers - Swiss Machine Pin <https://www.sparkfun.com/products/743> (PRT-00743) For SCREWTERMINALS and SPRING TERMINALS visit here: Screw Terimnals on SparkFun.com <https://www.sparkfun.com/search/results?term=Screw+Terminals> (5mm/3.5mm/2.54mm spacing) This device is also useful as a general connection point to wire up your design to another part of your project. Our various solder wires solder well into these plated through hole pads. Hook-Up Wire - Assortment (Stranded, 22 AWG) <https://www.sparkfun.com/products/11375> (PRT-11375) Hook-Up Wire - Assortment (Solid Core, 22 AWG) <https://www.sparkfun.com/products/11367> (PRT-11367) View the entire wire category on our website here <https://www.sparkfun.com/categories/141> Special notes: Molex polarized connector foot print use with SKU : PRT-08231 with associated crimp pins and housings. 1MM SMD Version SKU: PRT-10208; PROD_ID: CONN-09696
J7 = SparkFun-Connectors:M06: Header 6 Standard 6-pin 0.1" header. Use with straight break away headers (SKU : PRT-00116), right angle break away headers (PRT-00553), swiss pins (PRT-00743), machine pins (PRT-00117), and female headers (PRT-00115). Molex polarized connector foot print use with SKU : PRT-08094 with associated crimp pins and housings. NOTES ON THE VARIANTS LOCK and LOCK_LONGPADS... This footprint was designed to help hold the alignment of a through-hole component (i.e. 6-pin header) while soldering it into place. You may notice that each hole has been shifted either up or down by 0.005 of an inch from it's more standard position (which is a perfectly straight line). This slight alteration caused the pins (the squares in the middle) to touch the edges of the holes. Because they are alternating, it causes a "brace" to hold the component in place. 0.005 has proven to be the perfect amount of "off-center" position when using our standard breakaway headers. Although looks a little odd when you look at the bare footprint, once you have a header in there, the alteration is very hard to notice. Also,if you push a header all the way into place, it is covered up entirely on the bottom side. This idea of altering the position of holes to aid alignment will be further integrated into the Sparkfun Library for other footprints. It can help hold any component with 3 or more connection pins.; PROD_ID: CONN-08437
L1 = inductors:BLM15H: EMIFIL (R) Chip Ferrite Bead for GHz Noise Source: http://www.murata.com/ Ferrite Bead BLM15H.pdf
Q1 = nxp_60_1_1:2N7002: N-channel TrenchMOS FET N-channel enhancement mode Field-Effect Transistor (FET) in a plastic package using TrenchMOS technology. AAL Eindhoven MK
Q2 = SparkFun-DiscreteSemi:TRANS_NPN_DUAL: Dual NPN Transistors in Single Package The MBT3904W1 puts two general purpose 3904 NPN transistors in a single package. Datasheet <http://www.onsemi.com/pub_link/Collateral/MBT3904DW1T1-D.PDF> SparkFun Products: SparkFun ESP32 Thing <https://www.sparkfun.com/products/13907>; PROD_ID: TRANS-13337
Q3 = SparkFun-DiscreteSemi:MOSFET-NCH: N-channel MOSFETs Voltage controlled devices that allow control of high current outputs. SparkFun Products: SparkFun OpenScale <https://www.sparkfun.com/products/13261> SparkFun Digital Sandbox <https://www.sparkfun.com/products/12651> SparkFun Monster Moto Shield <https://www.sparkfun.com/products/10182> SparkFun MOSFET Power Controller <https://www.sparkfun.com/products/11214>; PROD_ID: TRANS-11151
Q4 Q5 = SparkFun-DiscreteSemi:MOSFET_PCH: P-channel MOSFETs Voltage controlled devices that allow control of high current outputs. SparkFun Products: SparkFun ESP32 Thing <https://www.sparkfun.com/products/13907> SparkFun ESP8266 Thing <https://www.sparkfun.com/products/13231>; PROD_ID: TRANS-13060; VALUE: 24A/20V/50mΩ
R1 R2 = rcl:R-EU_: RESISTOR, European symbol
R3 R5 R6 R8-R16 R20-R33 R38-R49 = SparkFun-Resistors:1.5KOHM: 1.5kΩ resistor A resistor is a passive two-terminal electrical component that implements electrical resistance as a circuit element. Resistors act to reduce current flow, and, at the same time, act to lower voltage levels within circuits. - Wikipedia; PROD_ID: RES-08306; VALUE: 1.5k
R4 = SparkFun-Resistors:1.5KOHM: 1.5kΩ resistor A resistor is a passive two-terminal electrical component that implements electrical resistance as a circuit element. Resistors act to reduce current flow, and, at the same time, act to lower voltage levels within circuits. - Wikipedia; PROD_ID: RES-08306
R7 R17 = SparkFun-Resistors:0.1OHM: 0.1Ω resistor A resistor is a passive two-terminal electrical component that implements electrical resistance as a circuit element. Resistors act to reduce current flow, and, at the same time, act to lower voltage levels within circuits. - Wikipedia; PROD_ID: RES-12374; VALUE: 0.1
R18 R19 R34 R37 R50 R52-R54 = SparkFun-Resistors:100KOHM: 100kΩ resistor A resistor is a passive two-terminal electrical component that implements electrical resistance as a circuit element. Resistors act to reduce current flow, and, at the same time, act to lower voltage levels within circuits. - Wikipedia; PROD_ID: RES-07828; VALUE: 100k
R51 = SparkFun-Resistors:100KOHM: 100kΩ resistor A resistor is a passive two-terminal electrical component that implements electrical resistance as a circuit element. Resistors act to reduce current flow, and, at the same time, act to lower voltage levels within circuits. - Wikipedia; PROD_ID: RES-07828
R55 R56 = SparkFun-Resistors:1KOHM: 1kΩ resistor A resistor is a passive two-terminal electrical component that implements electrical resistance as a circuit element. Resistors act to reduce current flow, and, at the same time, act to lower voltage levels within circuits. - Wikipedia; PROD_ID: RES-07856; VALUE: 1k
S1 = SparkFun-Switches:ENCODER-SWITCH: Rotary Encoder w/ Select Switch Encoders rotate similarly to potentiometers, but they’re different from potentiometers in that an encoder has full rotation without limits. They output gray code so that you can tell how much and in which direction the encoder has been turned. This encoder includes a push-down select switch built into the shaft. SparkFun Products Rotary Encoder <https://www.sparkfun.com/products/9117> (COM-09117); SF_SKU: COM-09117
S2 = SparkFun-Switches:MOMENTARY-SWITCH-SPST: Momentary Switch (Pushbutton) - SPST Normally-open (NO) SPST momentary switches (buttons, pushbuttons). Variants PTH-12MM - 12mm square, through-hole Momentary Pushbutton Switch - 12mm Square <https://www.sparkfun.com/products/9190> (COM-09190) PTH-6.0MM, PTH-6.0MM-KIT - 6.0mm square, through-hole Mini Pushbutton Switch <https://www.sparkfun.com/products/97> (COM-00097) KIT package intended for soldering kit's - only one side of pads' copper is exposed. PTH-RIGHT-ANGLE-KIT - Right-angle, through-hole Right Angle Tactile Button <https://www.sparkfun.com/products/10791> - Used on SparkFun BigTime Watch Kit <https://www.sparkfun.com/products/11734> SMD-12MM - 12mm square, surface-mount Tactile Button - SMD (12mm) <https://www.sparkfun.com/products/12993> (COM-12993) Used on SparkFun PicoBoard <https://www.sparkfun.com/products/11888> SMD-4.5MM - 4.5mm Square Trackball Switch Used on SparkFun Blackberry Trackballer Breakout <https://www.sparkfun.com/products/13169> SMD-4.6MMX2.8MM - 4.60mm x 2.80mm, surface mount Used on SparkFun SAMD21 Mini Breakout <https://www.sparkfun.com/products/13664> SMD-5.2MM, SMD-5.2-REDUNDANT - 5.2mm square, surface-mount Mini Pushbutton Switch - SMD <https://www.sparkfun.com/products/8720> (COM-08720) Used on Arduino Pro Mini <https://www.sparkfun.com/products/11114> REDUNDANT package connects both switch circuits together SMD-6.0X3.5MM - 6.0 x 3.5mm, surface mount Momentary Reset Switch SMD <https://www.sparkfun.com/products/8229> (COM-08229) SMD-6.2MM-TALL - 6.2mm square, surface mount Tactile Button - SMD (6mm) <https://www.sparkfun.com/products/12992> Used on SparkFun Digital Sandbox <https://www.sparkfun.com/products/12651> SMD-RIGHT-ANGLE - Right-angle, surface mount Used on SparkFun Block for Intel® Edison - Arduino <https://www.sparkfun.com/products/13036>; PROD_ID: CONN-10672; SF_SKU: COM-10791
SW1 SW2 = Seeed-OPL-Switch:SMD-BUTTON(2P-6.0X3.0X2.5MM): 311020029
U1 U2 = SparkFun-IC-Power:V_REG_317: Voltage Regulator Standard LM317 adjustable voltage regulator. AOI (Adjust Output Input). Google 'LM317 Calculator' for easy to use app to get the two resistor values needed. 240/720 for 5V output. 240/390 for 3.3V output. Spark Fun Electronics SKU : COM-00527
U3 = esp32:ESP-WROOM-32
U4 = SparkFun-IC-Comms:FT231X: FTDI FT231X Full Speed USB to Full-handshake UART This USB2.0 Full Speed IC offers a compact bridge to full handshake UART interfaces. The device is a UART, capable of operating up to 3MBaud, with low power consumption (8mA). The FT231X includes the complete FT-X series feature set and enables USB to be added into a system design quickly and easily over a UART interface. Datasheet <http://cdn.sparkfun.com/datasheets/Components/General%20IC/DS_FT231X.pdf> SparkFun Products SparkFun RedBoard - Programmed with Arduino <https://www.sparkfun.com/products/12757> (DEV-12757) SparkFun XBee Explorer USB <https://www.sparkfun.com/products/11812> (WRL-11812) SparkFun XBee Explorer Dongle <https://www.sparkfun.com/products/11697> (WRL-11697) SparkFun Blynk Board - ESP8266 <https://www.sparkfun.com/products/13794> (WRL-13794) SparkFun ESP8266 Thing - Dev Board <https://www.sparkfun.com/products/13711> (WRL-13711) SparkFun Block for Intel® Edison - Base <https://www.sparkfun.com/products/13045> (DEV-13045) SparkFun RedStick <https://www.sparkfun.com/products/13741> (DEV-13741) SparkFun Beefy 3 - FTDI Basic Breakout <https://www.sparkfun.com/products/13746> (DEV-13746) SparkFun FT231X Breakout <https://www.sparkfun.com/products/11736> (BOB-11736); PROD_ID: IC-11524
U5 = LTC2950CTS8-1TRPBF:LTC2950CTS8-1TRPBF: Push Button On/Off Controller; AVAILABILITY: Unavailable; DESCRIPTION: PUSHBUTTON, CNTRL, 26.4VIN, 8TSOT23; SVHC: No SVHC _20-Jun-2013_; MF: Linear Technology/Analog; MP: LTC2950CTS8-1#TRPBF; PACKAGE: TSOT-23 Linear Technology; PRICE: None
U7 = SparkFun-IC-Power:V_REG_MIC5219: V_REG MIC5219 Standard 3.3V and 5V 500mA LDO voltage regulator in SOT-23 layout. Micrel part MIC5219. BP (by-pass) pin is used to lower output noise with 470pF cap, may be left open.; PROD_ID: VREG-09872

## Net classes
1 gnd: width 0.635 mm, drill 0.635 mm, clearance 0.254 mm
2 vcc: width 0.406 mm, drill 0.406 mm, clearance 0.254 mm